# Altium project RF-learn-command-1relay-220V.PrjPcb
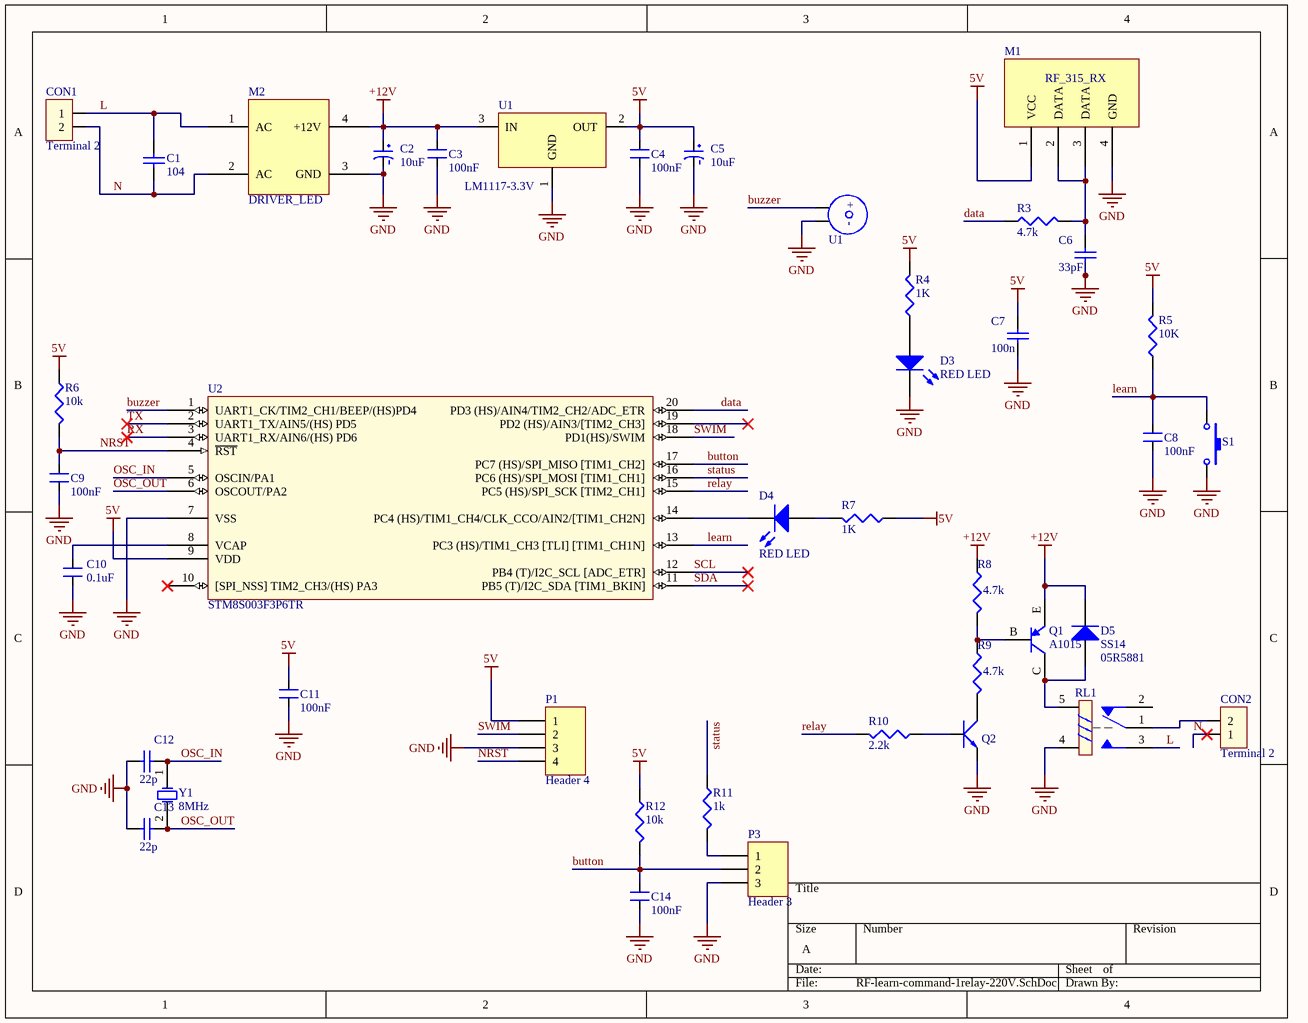
[diagram p0: RF-learn-command-1relay-220V.SchDoc]
1 sheet, 41 parts. Net scope: global (net labels, ports and power ports of the same name join across sheets).
Board file: RF-learn-command-1relay-220V.PcbDoc

## Sheet RF-learn-command-1relay-220V.SchDoc
size A

### Parts
(Parts that share a designator on the sheet are numbered #1, #2 ... from top to bottom, then left to right.)
C1  value 104  [C_Ceramic_KV]  (hidden comment: Cap1)
C2  10uF  [CAP TANTALUM 3216]
C3  100nF  [CM 0805]
C4  100nF  [CM 0805]
C5  10uF  [CAP TANTALUM 3216]
C6  33pF  [CM 0805]
C7  100n  [CM 0805]
C8  100nF  [CM 0805]
C9  100nF  [CM 0805]
C10  0.1uF  [CM 0805]
C11  100nF  [CM 0805]
C12  22p  [CM 0805]
C13  22p  [CM 0805]
C14  100nF  [CM 0805]
CON1  Terminal 2  [domino-2pin-7.62]
CON2  Terminal 2  [domino-2pin-7.62]
D3  RED LED  [LED3mm-R]
D4  RED LED  [LED3mm-G]
D5  SS14  Supplier Part Number 1: 05R5881  [DO-214AC (SMA)]
M1  RF_315_RX  [Module-RF-RX]
M2  DRIVER_LED  [LED_DRIVER12V]
P1  Header 4  [HDR1X4]
P3  Header 3  [HEADER_3_W]
Q1  A1015  [SC-43-BCE]
Q2  C1815  [2SC1815]  (value not drawn)
R3  4.7k  [R0805]
R4  1K  [R0805]
R5  10K  [R0805]
R6  10k  [R0805]
R7  1K  [R0805]
R8  4.7k  [R0805]
R9  4.7k  [R0805]
R10  2.2k  [R0805]
R11  1k  [R0805]
R12  10k  [R0805]
RL1  Relay SPDT, 10A, 12V  [RL-SLA-24/12VDC-SL-C]  (value not drawn)
S1  SW-SMD  [Button Tactile Switch]  (value not drawn)
U1#1  LM1117-3.3V  [LM1117-SOP]
U1#2  Buzzer  [Buzzer]  (value not drawn)
U2  STM8S003F3P6TR  [SSOP-20]
Y1  8MHz  [HC49/US-SMD]

### Nets
5V: C4.2 C5.1 C7.1 C11.2 M1.1(VCC) P1.1 R4.2 R5.2 R6.1 R7.1 R12.1 U1#1.2(OUT) U2.9(VDD)
+12V: C2.1 C3.2 D5.2(K) M2.4(+12V) Q1.E R8.1 U1#1.3(IN)
GND: C2.2 C3.1 C4.1 C5.2 C6.2 C7.2 C8.1 C9.1 C10.1 C11.1 C12.1 C13.1 C14.1 D3.2(K) M1.4(GND) M2.3(GND) P1.3 P3.3 Q2.2(E) RL1.4 S1.2 U1#1.1(GND) U1#2.2 U2.7(VSS)
button: C14.2 P3.2 R12.2 U2.17(PC7_(HS)/SPI_MISO_[TIM1_CH2])
buzzer: U1#2.1 U2.1(UART1_CK/TIM2_CH1/BEEP/(HS)PD4)
data: R3.1 U2.20(PD3_(HS)/AIN4/TIM2_CH2/ADC_ETR)
L: C1.2 CON1.1 M2.1(AC) RL1.3
learn: C8.2 R5.1 S1.1 U2.13(PC3_(HS)/TIM1_CH3_[TLI]_[TIM1_CH1N])
N: C1.1 CON1.2 CON2.1 M2.2(AC)
NRST: C9.2 P1.4 R6.2 U2.4(~{RST})
OSC_IN: C12.2 U2.5(OSCIN/PA1) Y1.1(OSC1)
OSC_OUT: C13.2 U2.6(OSCOUT/PA2) Y1.2(OSC2)
relay: R10.2 U2.15(PC5_(HS)/SPI_SCK_[TIM2_CH1])
RX: U2.3(UART1_RX/AIN6/(HS)_PD6)
SCL: U2.12(PB4_(T)/I2C_SCL_[ADC_ETR])
SDA: U2.11(PB5_(T)/I2C_SDA_[TIM1_BKIN])
status: R11.1 U2.16(PC6_(HS)/SPI_MOSI_[TIM1_CH1])
SWIM: P1.2 U2.18(PD1(HS)/SWIM)
TX: U2.2(UART1_TX/AIN5/(HS)_PD5)
NetC6_1: C6.1 M1.2(DATA) M1.3(DATA) R3.2
NetC10_2: C10.2 U2.8(VCAP)
NetCON2_2: CON2.2 RL1.1
NetD3_1: D3.1(A) R4.1
NetD4_1: D4.1(A) R7.2
NetD4_2: D4.2(K) U2.14(PC4_(HS)/TIM1_CH4/CLK_CCO/AIN2/[TIM1_CH2N])
NetD5_1: D5.1(A) Q1.C RL1.5
NetP3_1: P3.1 R11.2
NetQ1_B: Q1.B R8.2 R9.1
NetQ2_1: Q2.1(B) R10.1
NetQ2_3: Q2.3(C) R9.2

Not connected (* = marked no-connect by the designer): RL1 2; U2 10([SPI_NSS]_TIM2_CH3/(HS)_PA3)* 19(PD2_(HS)/AIN3/[TIM2_CH3])*

### Notes on the sheet
- (in symbol Buzzer) +; -
- (in symbol CM Tantalum) -

### Library data of the parts
C1 = Cap1: Polar Capacitor; Published: 8-Jun-2000; LatestRevisionDate: 17-Jul-2002; LatestRevisionNote: Re-released for DXP Platform.; PackageReference: RAD-0.3; Publisher: Altium Limited; PackageDescription: Radial Cap, Thru-Hole; 2 Leads; 0.3 in Pin Spacing
C2 C5 = CM Tantalum: SMD Tantalum Capacitor; Manufacturer No: TAJE106K035RNJ; Manufacturer: AVX; Voltage: 35V; Tolerance: 10%; Capacitance: 10uF; Specification: ="Capacitance"+" "+"Voltage"+" " +"Tolerance"
C3 C4 C8-C11 C14 = CM Ceramic: SMD Ceramic  Capacitor; Manufacturer No: C0805KRX7R9BB104; Manufacturer: Yageo; Voltage: 50V; Tolerance: 10%; Specification: ="Capacitance"+" "+"Voltage"+" " +"Tolerance"
  C3 C4 C8 C9 C11 C14: Capacitance: 100nF
  C10: Capacitance: 0.1uF
C6 C7 = Cap Semi: Capacitor 100n 16V 0603; Published: 8-Jun-2000; LatestRevisionDate: 29-May-2009; LatestRevisionNote: IPC-7351 Footprint Added.; PackageReference: C1206; Publisher: Altium Limited; PackageDescription: Chip Capacitor
C12 C13 = Cap Semi: Capacitor (Semiconductor SIM Model); Published: 8-Jun-2000; LatestRevisionDate: 29-May-2009; LatestRevisionNote: IPC-7351 Footprint Added.; PackageReference: C1206; Publisher: Altium Limited; PackageDescription: Chip Capacitor
CON1 CON2 = Terminal 2: Value: Connector 2
D3 D4 = LED2: LED SUPR RED CLR 0805 RT ANG SMD; Manufacturer: Lite-On Inc; Manufacturer Part Number: LTST-S220KRKT; Value: LED RED; Published: 8-Jun-2000; LatestRevisionDate: 17-Jul-2002; LatestRevisionNote: Re-released for DXP Platform.; PackageVersion: Feb-2002; PackageReference: 3.2X1.6X1.1; Publisher: Altium Limited; Digi-Key Part Number: 160-1469-2-ND; Unit Price: 0.03780
D5 = Diode: DIODE GEN PURPOSE 1000V 1A SMA; Manufacturer Part Number: CGRA4007-G; Manufacturer: Comchip Technology; Value: 1N4007; Published: 8-Jun-2000; LatestRevisionDate: 17-Jul-2002; LatestRevisionNote: Re-released for DXP Platform.; PackageVersion: Sep-1996; PackageReference: DO-214-AA; Publisher: Altium Limited; Code_JEDEC: DO-214-AB; Digi-Key Part Number: 641-1018-1-ND; Unit Price: 0.05130; Supplier 1: Newark
M1 = ModuleRF-RX
M2 = LED_DRIVER12V
P1 = Header 4: Header, 4-Pin; LatestRevisionDate: 17-Jul-2002; LatestRevisionNote: Re-released for DXP Platform.; Publisher: Altium Limited
P3 = Header 3: Header, 3-Pin; LatestRevisionDate: 17-Jul-2002; LatestRevisionNote: Re-released for DXP Platform.; Publisher: Altium Limited
Q1 = PNP Transistor
Q2 = C1815: NPN SMD Transistor; Manufacturer No: 2SC1815-HF; Manufacturer: Toshiba; Vendor: BL Galaxy Electrical; Vendor_Vietnam: TME; Value: C1815; Specification: C1815
R3 R8-R11 = Res3: Resistor; Manufacturer: Vishay / Draloric; Manufacturer Part Number: RCV0805301KFKEA; Value: 10k; Power Rating: 125 mW (1/8 W); Resistance: 301 kOhms; Temperature Coefficient: 100 PPM / K; Tolerance: 1 %; Voltage Rating: 400 V; Case Height: 0.45 mm; Case Length: 2 mm; Case Width: 1.25 mm; Product Status: New Product; Published: 8-Jun-2000; LatestRevisionDate: 29-May-2009; LatestRevisionNote: IPC-7351 Footprint Added.; PackageReference: J1-0603; Publisher: Altium Limited; PackageDescription: Chip Resistor; Supplier 1: Mouser; Supplier Part Number 1: 71-RCV0805301KFKEA; RoHS: RoHS Compliant; Category: Thick Film Resistors - SMD; Stock 1: 5000; Pricing 1: 1=0.330, 50=0.177, 100=0.102, 500=0.069, 1000=0.054, 5000=0.051, 10000=0.048, 15000=0.040, 25000=0.033 (USD); Operating Temperature Range: - 55 C to + 155 C; Package / Case: 0805 (2012 metric); Packaging: Reel; Product: Thick Film Resistors SMD; Series: RCV; Case Code - in: 0805; Case Code - mm: 2012; Product Category: 0805 Thick Film Chip Resistors; RoHS - Mouser: Y; Minimum Order Quantity: 1; Reeling: True; ComponentLink1URL: http://www.vishay.com/docs/20054/rcve3.pdf; ComponentLink1Description: http://www.vishay.com/docs/20054/rcve3.pdf
R4 R5 R7 = Res3: Resistor 10k 0603; Published: 8-Jun-2000; LatestRevisionDate: 29-May-2009; LatestRevisionNote: IPC-7351 Footprint Added.; PackageReference: J1-0603; Publisher: Altium Limited; PackageDescription: Chip Resistor
R6 R12 = Res3: Resistor; Manufacturer: Vishay / Draloric; Manufacturer Part Number: RCV0805301KFKEA; Power Rating: 125 mW (1/8 W); Resistance: 301 kOhms; Temperature Coefficient: 100 PPM / K; Tolerance: 1 %; Voltage Rating: 400 V; Case Height: 0.45 mm; Case Length: 2 mm; Case Width: 1.25 mm; Product Status: New Product; Published: 8-Jun-2000; LatestRevisionDate: 29-May-2009; LatestRevisionNote: IPC-7351 Footprint Added.; PackageReference: J1-0603; Publisher: Altium Limited; PackageDescription: Chip Resistor; Value: 10k; Supplier 1: Mouser; Supplier Part Number 1: 71-RCV0805301KFKEA; RoHS: RoHS Compliant; Category: Thick Film Resistors - SMD; Stock 1: 5000; Pricing 1: 1=0.330, 50=0.177, 100=0.102, 500=0.069, 1000=0.054, 5000=0.051, 10000=0.048, 15000=0.040, 25000=0.033 (USD); Operating Temperature Range: - 55 C to + 155 C; Package / Case: 0805 (2012 metric); Packaging: Reel; Product: Thick Film Resistors SMD; Series: RCV; Case Code - in: 0805; Case Code - mm: 2012; Product Category: 0805 Thick Film Chip Resistors; RoHS - Mouser: Y; Minimum Order Quantity: 1; Reeling: True; ComponentLink1URL: http://www.vishay.com/docs/20054/rcve3.pdf; ComponentLink1Description: http://www.vishay.com/docs/20054/rcve3.pdf
RL1 = Relay 1: Relay SPDT,10A - 12VDC 5 Pin; Value: Relay SPDT, 10A, 12V
S1 = SW-SMD: Switch; Published: 24-Mar-1999; LatestRevisionDate: 17-Jul-2002; LatestRevisionNote: Re-released for DXP Platform.; PackageReference: SPST-2; Publisher: Altium Limited
U1#1 = LM1117: 800mA Low-Dropout Linear Regulator; Creator: Nguyen Ba Bien; Website: http://group3i.net; Supplier 1: Digi-Key; Supplier Part Number 1: LM1117IMPX-3.3/NOPBCT-ND
U2 = STM8S003F3: MCU; Manufacturer: STMicroelectronics; Program Memory Type: Flash; A/D Bit Size: 10 bit; A/D Channels Available: 5; Data RAM Size: 1 KB; Data ROM Size: 128 B; Interface Type: I2C, SPI, UART; Program Memory Size: 8 KB; Core: STM8; Data Bus Width: 8 bit; Maximum Clock Frequency: 16 MHz; Number of Timers: 3; On-Chip ADC: Yes; On-Chip DAC: No; Operating Supply Voltage: 2.95 V to 5.5 V; Supply Voltage - Max: 5.5 V; Supply Voltage - Min: 2.95 V; Product Status: New Product; Supplier 1: Mouser; Supplier Part Number 1: 511-STM8S003F3P6TR; Manufacturer Part Number: STM8S003F3P6TR; RoHS: RoHS Compliant; Category: 8-bit Microcontrollers - MCU; Stock 1: 2832; Pricing 1: 1=0.910, 10=0.703, 100=0.559, 500=0.510, 1000=0.390, 2500=0.346, 10000=0.332, 25000=0.322 (USD); Package / Case: TSSOP-20; Packaging: Reel; Mounting Style: SMD/SMT; Maximum Operating Temperature: + 85 C; Minimum Operating Temperature: - 40 C; RoHS - Mouser: Y; Minimum Order Quantity: 1; Reeling: True; ComponentLink1URL: http://www.st.com/web/catalog/mmc/FM141/SC1244/SS1010/LN2/PF251792?referrer=70032480; ComponentLink1Description: http://www.st.com/web/catalog/mmc/FM141/SC1244/SS1010/LN2/PF251792?referrer=70032480; Supplier 2: Digi-Key
Y1 = XTAL: Crystal Oscillator; Published: 8-Jun-2000; LatestRevisionDate: 17-Jul-2002; LatestRevisionNote: Re-released for DXP Platform.; PackageReference: R38; Publisher: Altium Limited; Supplier 1: Newark; Supplier Part Number 1: 90B5422